# Altium schematic sheet padometer.SchDoc
size A4
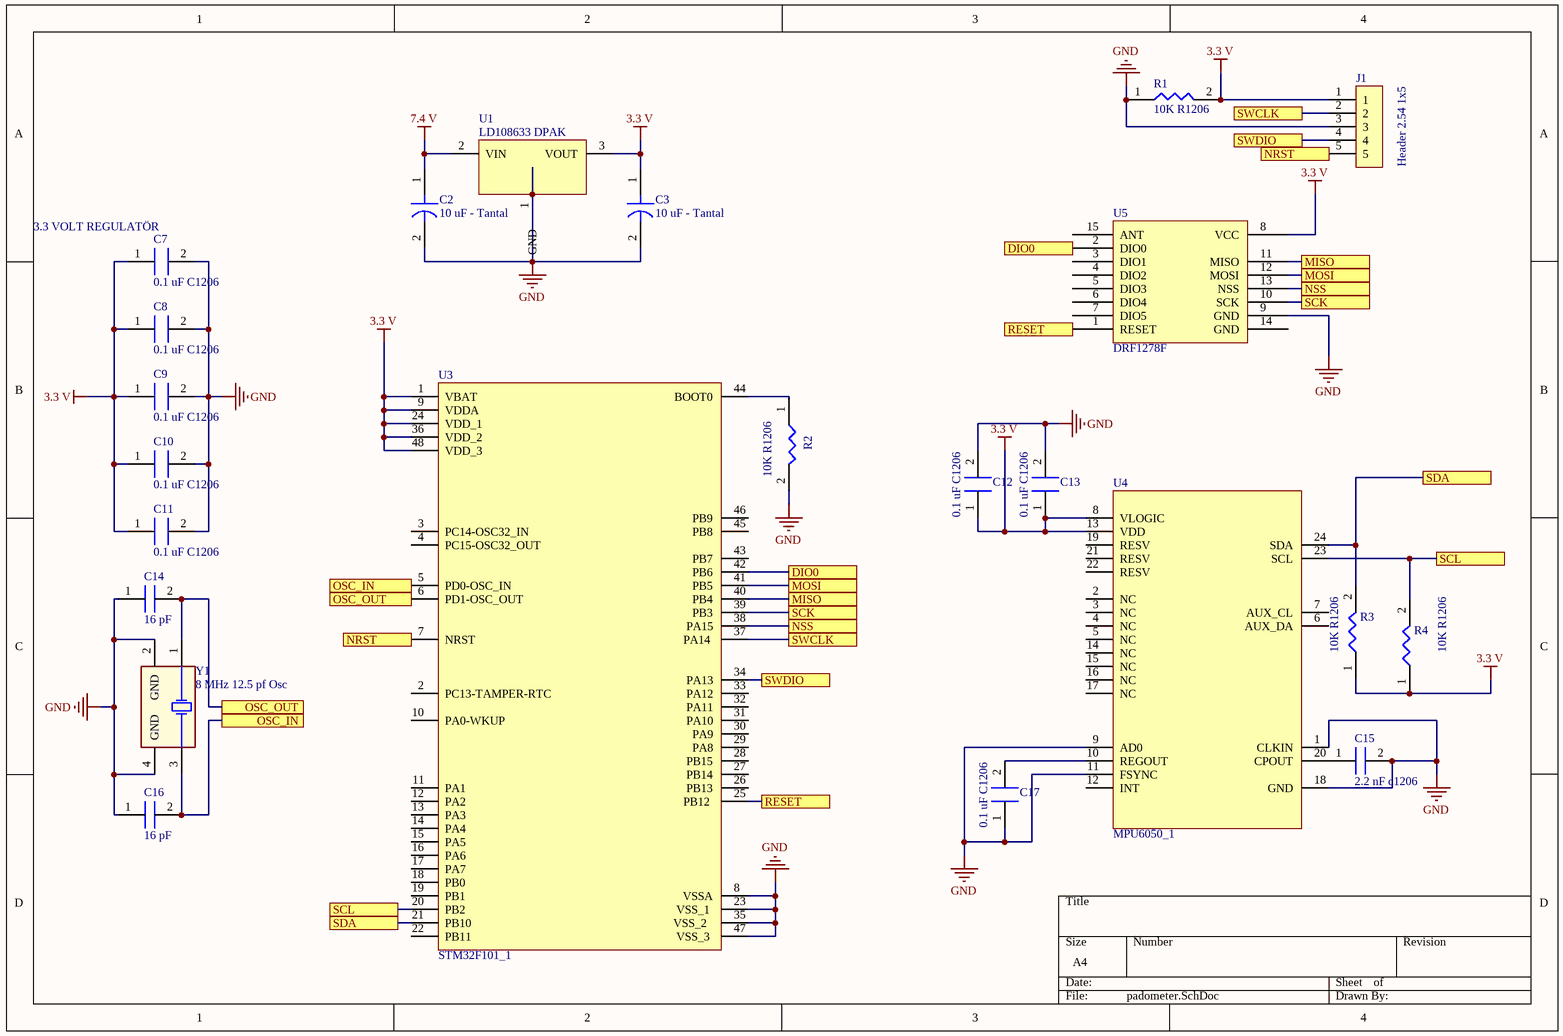
[diagram p0: padometer.SchDoc]

## Parts
C2  10 uF - Tantal  [C1206- TANTAL]
C3  10 uF - Tantal  [C1206- TANTAL]
C7  0.1 uF C1206  [C1206]
C8  0.1 uF C1206  [C1206]
C9  0.1 uF C1206  [C1206]
C10  0.1 uF C1206  [C1206]
C11  0.1 uF C1206  [C1206]
C12  0.1 uF C1206  [C1206]
C13  0.1 uF C1206  [C1206]
C14  16 pF  [C1206]
C15  2.2 nF c1206  [C1206]
C16  16 pF  [C1206]
C17  0.1 uF C1206  [C1206]
J1  Header 2.54 1x5  [Header 2.54 1x5]
R1  10K R1206  [R1206 Resıstor]
R2  10K R1206  [R1206 Resıstor]
R3  10K R1206  [R1206 Resıstor]
R4  10K R1206  [R1206 Resıstor]
U1  LD108633 DPAK  [DPAK228P972X230-3N]
U3  STM32F101_1  [LQFP48-STM]
U4  MPU6050_1  [QFN50P400X400X90_HS-25N]
U5  DRF1278F  [DRF1278F]
Y1  8 MHz 12.5 pf Osc  [8 MHZ Osc.]

## Ports
DIO0, MISO, MOSI, NRST, NSS, OSC_IN, OSC_OUT, RESET, SCK, SCL, SDA, SWCLK, SWDIO

## Nets
3.3 V: C3.1 C7.1 C8.1 C9.1 C10.1 C11.1 C12.1 C13.1 J1.1 R1.2 R3.1 R4.1 U1.3(VOUT) U3.1(VBAT) U3.9(VDDA) U3.24(VDD_1) U3.36(VDD_2) U3.48(VDD_3) U4.8(VLOGIC) U4.13(VDD) U5.8(VCC)
7.4 V: C2.1 U1.2(VIN)
GND: C2.2 C3.2 C7.2 C8.2 C9.2 C10.2 C11.2 C12.2 C13.2 C14.1 C15.2 C16.1 C17.1 J1.3 R1.1 R2.2 U1.1(GND) U3.8(VSSA) U3.23(VSS_1) U3.35(VSS_2) U3.47(VSS_3) U4.1(CLKIN) U4.9(AD0) U4.11(FSYNC) U4.18(GND) U5.9(GND) Y1.2(GND) Y1.4(GND)
DIO0: U3.42(PB6) U5.2(DIO0) ; port DIO0
MISO: U3.40(PB4) U5.11(MISO) ; port MISO
MOSI: U3.41(PB5) U5.12(MOSI) ; port MOSI
NRST: J1.5 U3.7(NRST) ; port NRST
NSS: U3.38(PA15) U5.13(NSS) ; port NSS
OSC_IN: C16.2 U3.5(PD0-OSC_IN) Y1.3 ; port OSC_IN
OSC_OUT: C14.2 U3.6(PD1-OSC_OUT) Y1.1 ; port OSC_OUT
RESET: U3.25(PB12) U5.1(RESET) ; port RESET
SCK: U3.39(PB3) U5.10(SCK) ; port SCK
SCL: R4.2 U3.20(PB2) U4.23(SCL) ; port SCL
SDA: R3.2 U3.21(PB10) U4.24(SDA) ; port SDA
SWCLK: J1.2 U3.37(PA14) ; port SWCLK
SWDIO: J1.4 U3.34(PA13) ; port SWDIO
NetC15_1: C15.1 U4.20(CPOUT)
NetC17_2: C17.2 U4.10(REGOUT)
NetR2_1: R2.1 U3.44(BOOT0)

Not connected (* = marked no-connect by the designer): U3 2(PC13-TAMPER-RTC) 3(PC14-OSC32_IN) 4(PC15-OSC32_OUT) 10(PA0-WKUP) 11(PA1) 12(PA2) 13(PA3) 14(PA4) 15(PA5) 16(PA6) 17(PA7) 18(PB0) 19(PB1) 22(PB11) 26(PB13) 27(PB14) 28(PB15) 29(PA8) 30(PA9) 31(PA10) 32(PA11) 33(PA12) 43(PB7) 45(PB8) 46(PB9); U4 2(NC) 3(NC) 4(NC) 5(NC) 6(AUX_DA) 7(AUX_CL) 12(INT) 14(NC) 15(NC) 16(NC) 17(NC) 19(RESV) 21(RESV) 22(RESV); U5 3(DIO1) 4(DIO2) 5(DIO3) 6(DIO4) 7(DIO5) 14(GND) 15(ANT)

## Notes on the sheet
- (near C7) 3.3 VOLT REGULATÖR

## Library data of the parts
U1 = LD108633 DPAK: LD1086 3.3V REGULATOR
U3 = STM32F101_1: STM32F101 48 PİNLİ MİKROİŞLEMCİ
U4 = MPU6050_1: MPU6050 GYRO